# Altium schematic sheet pb-autoreverse.SchDoc
size A
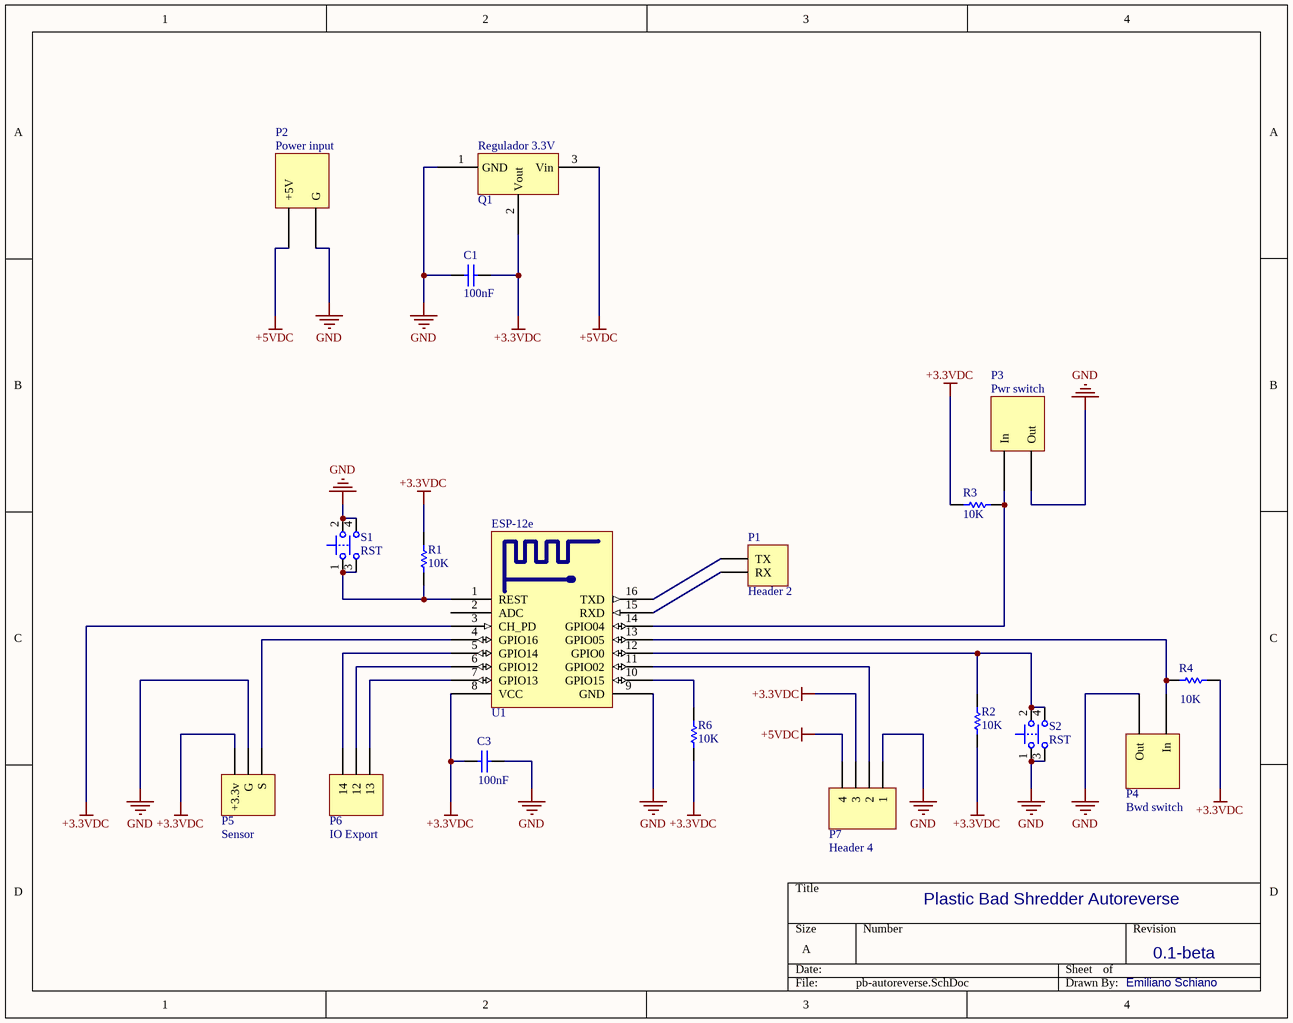
[diagram p0: pb-autoreverse.SchDoc]

## Parts
C1  100nf  [RAD-0.1]
C3  100nf  [RAD-0.1]
P1  Header 2  [HDR1X2]
P2  Power input  [ScrewTerminal-X2]
P3  Pwr switch  [ScrewTerminal-X2]
P4  Bwd switch  [ScrewTerminal-X2]
P5  Sensor  [HDR1X3]
P6  IO Export  [HDR1X3]
P7  Header 4  [HDR1X4]
Q1  Regulador 3.3V  [TO-220-AB]
R1  10K  [AXIAL-0.3]
R2  10K  [AXIAL-0.3]
R3  10K  [AXIAL-0.3]
R4  10K  [AXIAL-0.3]
R6  10K  [AXIAL-0.3]
S1  RST  [PushButton]
S2  RST  [PushButton]
U1  ESP-12e  [ESP_12]

## Nets
+3.3VDC: C1.2 C3.1 P5.3(+3.3v) P7.3 Q1.2(Vout) R1.1 R2.2 R3.2 R4.2 R6.1 U1.3(CH_PD) U1.8(VCC)
+5VDC: P2.1(+5V) P7.4 Q1.3(Vin)
GND: C1.1 C3.2 P2.2(G) P3.2(Out) P4.2(Out) P5.2(G) P7.1 Q1.1(GND) S1.2 S1.4 S2.1 S2.3 U1.9(GND)
NetP1_1: P1.1(TX) U1.16(TXD)
NetP1_2: P1.2(RX) U1.15(RXD)
NetP3_1: P3.1(In) R3.1 U1.14(GPIO04)
NetP4_1: P4.1(In) R4.1 U1.13(GPIO05)
NetP5_1: P5.1(S) U1.4(GPIO16)
NetP6_1: P6.1(13) U1.7(GPIO13)
NetP6_2: P6.2(12) U1.6(GPIO12)
NetP6_3: P6.3(14) U1.5(GPIO14)
NetP7_2: P7.2 U1.11(GPIO02)
NetR1_2: R1.2 S1.1 S1.3 U1.1(REST)
NetR2_1: R2.1 S2.2 S2.4 U1.12(GPIO0)
NetR6_2: R6.2 U1.10(GPIO15)

Not connected (* = marked no-connect by the designer): U1 2(ADC)

## Notes on the sheet
- Plastic Bad Shredder Autoreverse
- 0.1-beta
- Emiliano Schiano

## Library data of the parts
C1 C3 = Cap: Capacitor; Published: 8-Jun-2000; LatestRevisionDate: 17-Jul-2002; LatestRevisionNote: Re-released for DXP Platform.; PackageReference: RAD-0.3; Publisher: Altium Limited; PackageDescription: Radial Cap, Thru-Hole; 2 Leads; 0.3 in Pin Spacing; Value: 100nF
P1 = Header 2: Header, 2-Pin; LatestRevisionDate: 17-Jul-2002; LatestRevisionNote: Re-released for DXP Platform.; Publisher: Altium Limited
P2-P4 = ScrewTerminal
P5 P6 = Header 3: Header, 3-Pin; LatestRevisionDate: 17-Jul-2002; LatestRevisionNote: Re-released for DXP Platform.; Publisher: Altium Limited
P7 = Header 4: Header, 4-Pin; LatestRevisionDate: 17-Jul-2002; LatestRevisionNote: Re-released for DXP Platform.; Publisher: Altium Limited
Q1 = AMS1117
R1-R4 R6 = Res1: Resistor; Published: 8-Jun-2000; LatestRevisionDate: 17-Jul-2002; LatestRevisionNote: Re-released for DXP Platform.; PackageReference: AXIAL-0.3; Publisher: Altium Limited; PackageDescription: Axial Device, Thru-Hole; 2 Leads; 0.3 in Pin Spacing; Value: 10K
S1 S2 = IT-2175: Tactile Switch, DPST; Thru-Hole; Vertical; Rating DC 12V, 50mA (max); PackageDocument: Rev.0; Published: 6-Jun-2005; DatasheetDocument: Rev.0; PackageReference: IT-2175; Publisher: Altium Limited; ComponentLink1Description: Manufacturer Link; ComponentLink1URL: http://www.ilswitch.com/; ComponentLink2Description: Device Overview; ComponentLink2URL: http://www.ilswitch.com/list.php?ac_id=010112&ai_id=91
U1 = ESP-12